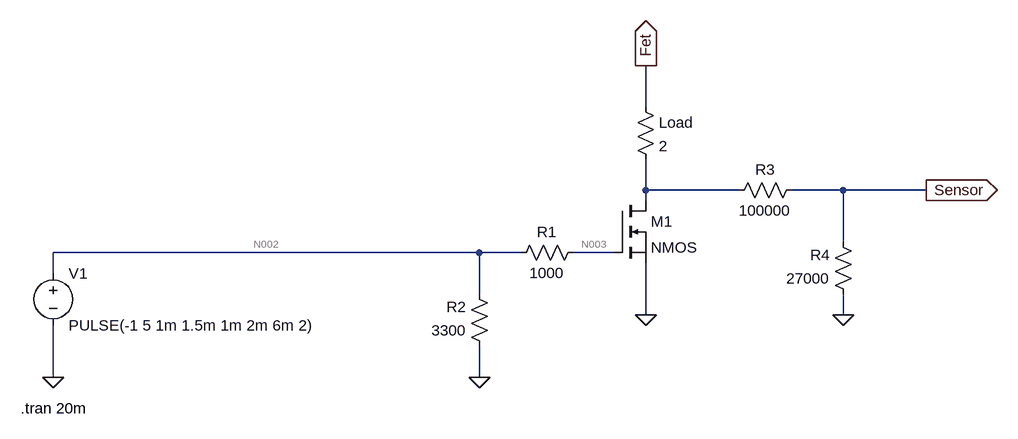
[diagram p0: schematic Simulation_Draft1.asc]
Simulation_Draft1.asc, the LTspice schematic file:
Version 4
SHEET 1 880 680
WIRE 176 -32 176 -96
WIRE 176 96 176 48
WIRE 320 96 176 96
WIRE 480 96 400 96
WIRE 608 96 480 96
WIRE 176 112 176 96
WIRE 480 176 480 96
WIRE -80 192 -736 192
WIRE -16 192 -80 192
WIRE 128 192 64 192
WIRE -736 224 -736 192
WIRE -80 256 -80 192
WIRE 176 288 176 208
WIRE 480 288 480 256
WIRE -736 384 -736 304
WIRE -80 384 -80 336
FLAG -80 384 0
FLAG -736 384 0
FLAG 176 288 0
FLAG 480 288 0
FLAG 608 96 Sensor
IOPIN 608 96 Out
FLAG 176 -96 Fet
IOPIN 176 -96 Out
SYMBOL nmos 128 112 R0
SYMATTR InstName M1
SYMBOL res 80 176 R90
WINDOW 0 0 56 VBottom 2
WINDOW 3 32 56 VTop 2
SYMATTR InstName R1
SYMATTR Value 1000
SYMBOL res -64 352 R180
WINDOW 0 36 76 Left 2
WINDOW 3 36 40 Left 2
SYMATTR InstName R2
SYMATTR Value 3300
SYMBOL res 416 80 R90
WINDOW 0 0 56 VBottom 2
WINDOW 3 32 56 VTop 2
SYMATTR InstName R3
SYMATTR Value 100000
SYMBOL res 496 272 R180
WINDOW 0 36 76 Left 2
WINDOW 3 36 40 Left 2
SYMATTR InstName R4
SYMATTR Value 27000
SYMBOL res 160 -48 R0
SYMATTR InstName Load
SYMATTR Value 2
SYMBOL voltage -736 208 R0
WINDOW 123 0 0 Left 0
WINDOW 39 0 0 Left 0
SYMATTR InstName V1
SYMATTR Value PULSE(-1 5 1m 1.5m 1m 2m 6m 2)
TEXT -786 432 Left 2 !.tran 20m

The netlist it stands for:
* Simulation_Draft1.asc
M1 N001 N003 0 0 NMOS
R1 N003 N002 1000
R2 0 N002 3300
R3 Sensor N001 100000
R4 0 Sensor 27000
R§Load Fet N001 2
V1 N002 0 PULSE(-1 5 1m 1.5m 1m 2m 6m 2)
.model NMOS NMOS
.model PMOS PMOS
.lib standard.mos
.tran 20m
.backanno
.end

* Results of the author's LTspice run, read from the files saved beside the schematic
* Operating Point, zero values left out:
*   V(n003) = -1 V
*   V(n002) = -1 V
*   I(R2) = 303 µA
*   I(V1) = 303 µA
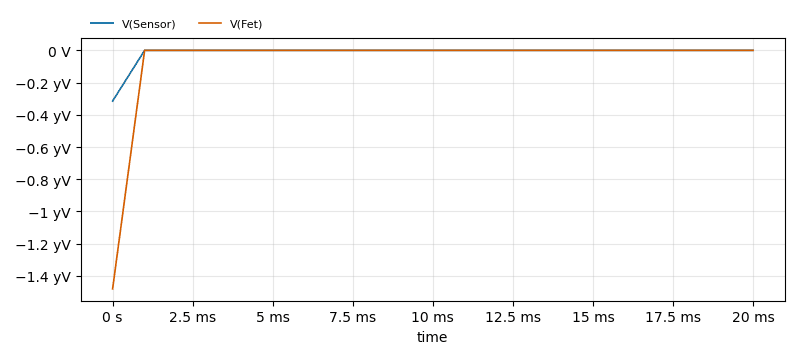
[diagram p1: Transient Analysis of Simulation_Draft1.asc, plotted from the saved traces]
* Transient Analysis, 1 run:
*   V(Sensor): min -3.146e-10 fV, max 0 V, average -7.865e-12 fV, rms 4.974e-11 fV, last 0 V
*   V(Fet): min -1.48e-09 fV, max 0 V, average -3.699e-11 fV, rms 2.34e-10 fV, last 0 V